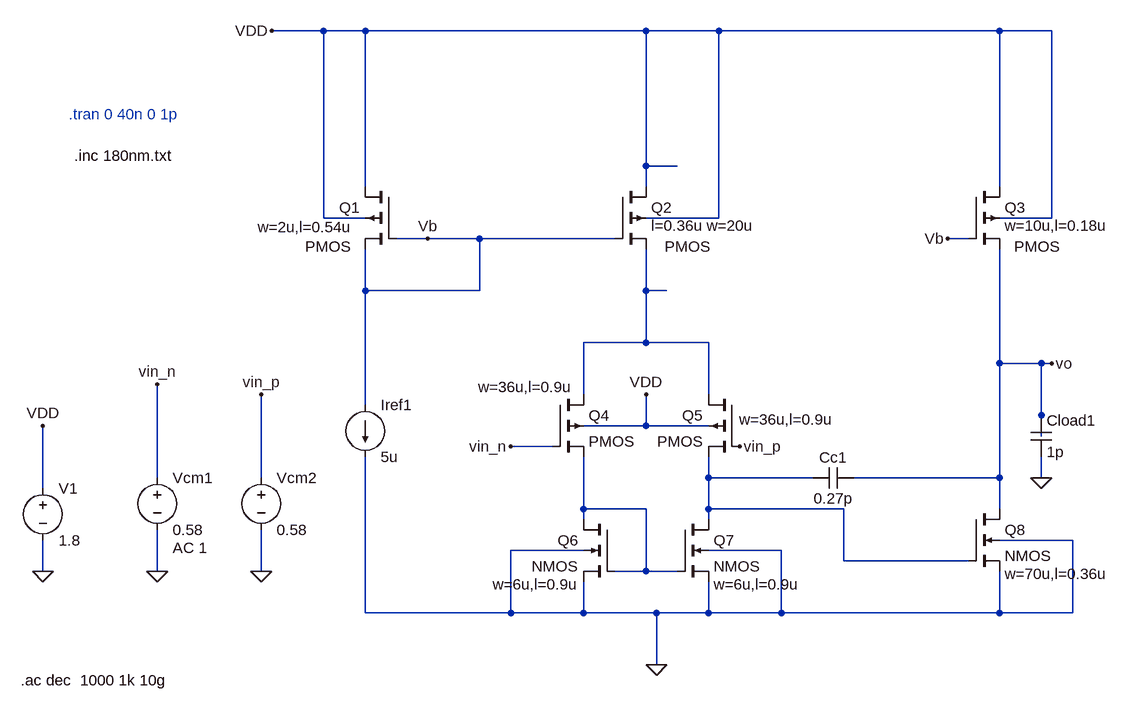
[diagram p0: schematic Draft1.asc]
Draft1.asc, the LTspice schematic file:
Version 4
SHEET 1 1592 680
WIRE -400 -448 -480 -448
WIRE -336 -448 -400 -448
WIRE 96 -448 -336 -448
WIRE 208 -448 96 -448
WIRE 640 -448 208 -448
WIRE 720 -448 640 -448
WIRE 96 -240 96 -448
WIRE 144 -240 96 -240
WIRE -336 -208 -336 -448
WIRE 96 -208 96 -240
WIRE 640 -208 640 -448
WIRE -400 -160 -400 -448
WIRE -336 -160 -400 -160
WIRE 208 -160 208 -448
WIRE 208 -160 96 -160
WIRE 720 -160 720 -448
WIRE 720 -160 640 -160
WIRE -240 -128 -288 -128
WIRE -160 -128 -240 -128
WIRE 48 -128 -160 -128
WIRE 592 -128 560 -128
WIRE -336 -48 -336 -112
WIRE -160 -48 -160 -128
WIRE -160 -48 -336 -48
WIRE 96 -48 96 -112
WIRE 128 -48 96 -48
WIRE 96 32 96 -48
WIRE 96 32 0 32
WIRE 192 32 96 32
WIRE 640 64 640 -112
WIRE 704 64 640 64
WIRE 720 64 704 64
WIRE 0 112 0 32
WIRE 192 112 192 32
WIRE -336 128 -336 -48
WIRE 704 144 704 64
WIRE 96 160 96 112
WIRE 96 160 0 160
WIRE 192 160 96 160
WIRE 704 176 704 144
WIRE -48 192 -112 192
WIRE -656 240 -656 96
WIRE -496 240 -496 112
WIRE 192 240 192 208
WIRE 352 240 192 240
WIRE 640 240 640 64
WIRE 640 240 416 240
WIRE 704 240 704 208
WIRE -832 256 -832 160
WIRE 0 288 0 208
WIRE 96 288 0 288
WIRE 192 288 192 240
WIRE 400 288 192 288
WIRE 640 288 640 240
WIRE 0 304 0 288
WIRE 192 304 192 288
WIRE 752 336 640 336
WIRE 0 352 -112 352
WIRE 304 352 192 352
WIRE 400 368 400 288
WIRE 592 368 400 368
WIRE -832 384 -832 336
WIRE -656 384 -656 320
WIRE -496 384 -496 320
WIRE 96 384 96 288
WIRE 96 384 48 384
WIRE 144 384 96 384
WIRE -336 448 -336 208
WIRE -112 448 -112 352
WIRE -112 448 -336 448
WIRE 0 448 0 400
WIRE 0 448 -112 448
WIRE 112 448 0 448
WIRE 192 448 192 400
WIRE 192 448 112 448
WIRE 304 448 304 352
WIRE 304 448 192 448
WIRE 640 448 640 384
WIRE 640 448 304 448
WIRE 752 448 752 336
WIRE 752 448 640 448
WIRE 112 528 112 448
FLAG -112 192 vin_n
FLAG 240 192 vin_p
FLAG -480 -448 VDD
FLAG 720 64 vo
FLAG -496 384 0
FLAG -496 112 vin_p
FLAG -832 384 0
FLAG -832 160 VDD
FLAG 704 240 0
FLAG 112 528 0
FLAG 96 112 VDD
FLAG -240 -128 Vb
FLAG 560 -128 Vb
FLAG -656 96 vin_n
FLAG -656 384 0
DATAFLAG 96 -48 ""
DATAFLAG 480 368 ""
DATAFLAG 64 288 ""
DATAFLAG -160 -128 ""
DATAFLAG 128 -240 "Id(Q2)"
DATAFLAG 0 32 "Id(Q4)"
DATAFLAG 640 -272 "Id(Q3)"
SYMBOL pmos4 -288 -208 M0
WINDOW 3 70 92 Left 2
WINDOW 123 68 62 Left 2
SYMATTR Value2 w=2u,l=0.54u
SYMATTR InstName Q1
SYMBOL pmos4 48 -208 R0
WINDOW 3 77 92 Left 2
WINDOW 123 56 60 Left 2
SYMATTR Value2 l=0.36u w=20u
SYMATTR InstName Q2
SYMBOL pmos4 592 -208 R0
WINDOW 3 70 92 Left 2
WINDOW 123 56 60 Left 2
SYMATTR Value2 w=10u,l=0.18u
SYMATTR InstName Q3
SYMBOL pmos4 -48 112 R0
WINDOW 123 287 38 Left 2
SYMATTR Value2 w=36u,l=0.9u
SYMATTR InstName Q4
SYMBOL pmos4 240 112 M0
WINDOW 123 257 -12 Left 2
SYMATTR Value2 w=36u,l=0.9u
SYMATTR InstName Q5
SYMBOL nmos4 48 304 M0
WINDOW 123 56 100 Left 2
SYMATTR Value2 w=6u,l=0.9u
SYMATTR InstName Q6
SYMBOL nmos4 144 304 R0
WINDOW 123 56 100 Left 2
SYMATTR Value2 w=6u,l=0.9u
SYMATTR InstName Q7
SYMBOL nmos4 592 288 R0
WINDOW 123 56 100 Left 2
SYMATTR Value2 w=70u,l=0.36u
SYMATTR InstName Q8
SYMBOL cap 416 224 R90
WINDOW 0 0 32 VBottom 2
WINDOW 3 32 32 VTop 2
SYMATTR InstName Cc1
SYMATTR Value 0.27p
SYMBOL voltage -496 224 R0
WINDOW 123 24 124 Left 2
WINDOW 39 0 0 Left 0
SYMATTR InstName Vcm2
SYMATTR Value 0.58
SYMBOL voltage -832 240 R0
SYMATTR InstName V1
SYMATTR Value 1.8
SYMBOL current -336 128 R0
WINDOW 123 0 0 Left 0
WINDOW 39 0 0 Left 0
SYMATTR InstName Iref1
SYMATTR Value 5u
SYMBOL cap 688 144 R0
SYMATTR InstName Cload1
SYMATTR Value 1p
SYMBOL voltage -656 224 R0
WINDOW 123 24 124 Left 2
WINDOW 39 0 0 Left 0
SYMATTR Value2 AC 1
SYMATTR InstName Vcm1
SYMATTR Value 0.58
TEXT -784 -256 Left 2 !.inc 180nm.txt
TEXT -792 -320 Left 2 ;.tran 0 40n 0 1p
TEXT -866 552 Left 2 !.ac dec  1000 1k 10g

The netlist it stands for:
* Draft1.asc
M§Q1 VDD Vb Vb VDD PMOS w=2u,l=0.54u
M§Q2 VDD Vb N001 VDD PMOS l=0.36u w=20u
M§Q3 VDD Vb vo VDD PMOS w=10u,l=0.18u
M§Q4 N001 vin_n N003 VDD PMOS w=36u,l=0.9u
M§Q5 N001 vin_p N002 VDD PMOS w=36u,l=0.9u
M§Q6 N003 N003 0 0 NMOS w=6u,l=0.9u
M§Q7 N002 N003 0 0 NMOS w=6u,l=0.9u
M§Q8 vo N002 0 0 NMOS w=70u,l=0.36u
Cc1 vo N002 0.27p
Vcm2 vin_p 0 0.58
V1 VDD 0 1.8
Iref1 Vb 0 5u
Cload1 vo 0 1p
Vcm1 vin_n 0 0.58 AC 1
.model NMOS NMOS
.model PMOS PMOS
.lib standard.mos
.inc 180nm.txt
* .tran 0 40n 0 1p
.ac dec  1000 1k 10g
.backanno
.end